# Altium project MB1137.PrjPCB (part 2 of 2)
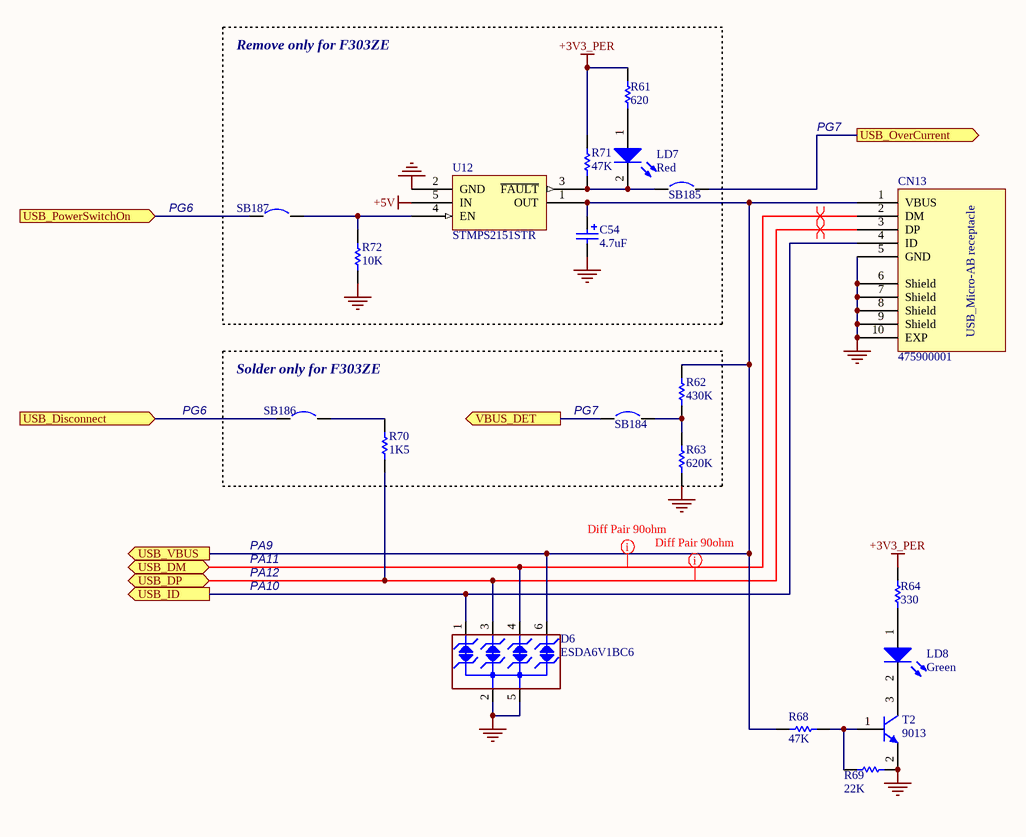
[diagram p6: USB.SchDoc]

## Nets that join several sheets
+3V3: MB1137 (JP5.1 SB2.1 SB3.2), Connectors (CN8.7 CN11.16 SB114.1)
+3V3_PER: MB1137 (SB2.2), Connectors (SB113.1 U7.5), ST_LINK_V2-1 (R25.1), Ethernet (8 pins), USB (R61.2 R64.2 R71.1)
+5V: MB1137 (8 pins), Connectors (CN8.9 CN11.18), ST_LINK_V2-1 (D2.1), USB (U12.5)
AGND: Connectors (CN10.3 CN12.32), MCU_144 (C34.2 SB162.2 SB166.1 U8.31)
AVDD: Connectors (CN7.6 CN10.1 CN12.7), MCU_144 (C34.1 SB12.2 U8.32 U8.33)
E5V: MB1137 (JP3.2), Connectors (CN11.6), ST_LINK_V2-1 (D3.1)
GND: MB1137 (14 pins), Connectors (27 pins), ST_LINK_V2-1 (44 pins), Ethernet (20 pins), MCU_144 (40 pins), USB (14 pins)
U5V: MB1137 (6 pins), Connectors (CN12.8), ST_LINK_V2-1 (5 pins)
VBAT: Connectors (CN11.33), MCU_144 (C57.1 SB156.2 U8.6)
VDD: MB1137 (JP5.2), Connectors (CN11.5), MCU_144 (33 pins)
VIN: MB1137 (C17.1 U5.3), Connectors (CN8.15 CN11.24)
VIN_5V: MB1137 (C18.1 JP3.6 U5.2 U5.4), ST_LINK_V2-1 (D4.1)
BOOT0: Connectors (CN11.7), MCU_144 (R36.1 U8.138)
MCO: ST_LINK_V2-1 (SB112.2), MCU_144 (SB149.1)
NetC54_1: MCU_144 (R35.1), USB (6 pins)
NetCN5_1: ST_LINK_V2-1 (CN5.1 U2.13), MCU_144 (SB5.1)
NetCN5_2: ST_LINK_V2-1 (CN5.2 U2.12), MCU_144 (SB6.1)
NetCN9_15: Connectors (CN9.15 SB136.1), Ethernet (R40.2), MCU_144 (JP6.2)
NetCN13_2: MCU_144 (SB133.1), USB (CN13.2 D6.4)
NetCN13_3: MCU_144 (SB132.1), USB (CN13.3 D6.3 R70.1)
NetCN13_4: MCU_144 (SB125.1), USB (CN13.4 D6.1)
NetJP4_1: MCU_144 (JP4.1), USB (SB184.1 SB185.2)
NetJP7_1: Ethernet (U9.18), MCU_144 (JP7.1)
NetR27_2: MB1137 (R27.2 U4.3), ST_LINK_V2-1 (U2.28)
NetR42_2: Ethernet (R42.2), MCU_144 (SB178.1)
NetR45_2: Ethernet (R45.2), MCU_144 (SB181.1)
NetR46_1: Ethernet (R46.1 U9.12), MCU_144 (SB160.1)
NetR48_2: Ethernet (R48.2), MCU_144 (SB13.1)
NetSB164_1: Ethernet (U9.13), MCU_144 (SB164.1)
NetSB182_2: Ethernet (U9.17), MCU_144 (SB182.2)
NetSB183_2: Ethernet (U9.16), MCU_144 (SB183.2)
NRST: Connectors (CN8.5 CN11.14), ST_LINK_V2-1 (SB111.2), Ethernet (SB177.1), MCU_144 (B2.2 B2.3 C53.2 U8.25)
PA0: Connectors (CN11.28 SB179.1), MCU_144 (SB180.2 U8.34)
PA1: Connectors (CN11.30 SB11.2), MCU_144 (SB13.2 U8.35)
PA2: Connectors (CN12.35 SB159.1), MCU_144 (SB160.2 U8.36)
PA3: Connectors (CN9.1 CN12.37), MCU_144 (U8.37)
PA4: Connectors (CN7.17 CN11.32), MCU_144 (U8.40)
PA5: Connectors (CN7.10 CN12.11 SB119.2), MCU_144 (U8.41)
PA6: Connectors (CN7.12 CN12.13), MCU_144 (U8.42)
PA7: Connectors (CN12.15 SB121.2), MCU_144 (JP6.1 U8.43)
PA8: Connectors (CN12.23 SB115.2), MCU_144 (TP1.1 U8.100)
PA9: Connectors (CN12.21 SB128.2), MCU_144 (SB127.2 U8.101)
PA10: Connectors (CN12.33 SB126.2), MCU_144 (SB125.2 U8.102)
PA11: Connectors (CN12.14), MCU_144 (SB133.2 U8.103)
PA12: Connectors (CN12.12), MCU_144 (SB132.2 U8.104)
PA13: Connectors (CN11.13), ST_LINK_V2-1 (SB108.1), MCU_144 (U8.105)
PA14: Connectors (CN11.15), ST_LINK_V2-1 (SB103.1), MCU_144 (U8.109)
PA15: Connectors (CN7.9 CN11.17), MCU_144 (U8.110)
PB0: Connectors (CN10.31 CN11.34 SB120.1), MCU_144 (U8.46)
PB1: Connectors (CN10.7 CN12.24), MCU_144 (U8.47)
PB2: Connectors (CN10.15 CN12.22 SB137.2), MCU_144 (R73.1 U8.48)
PB3: Connectors (CN7.15 CN12.31), ST_LINK_V2-1 (SB110.2), MCU_144 (U8.133)
PB4: Connectors (CN7.19 CN12.27), MCU_144 (U8.134)
PB5: Connectors (CN7.13 CN12.29 SB122.2), MCU_144 (U8.135)
PB6: Connectors (CN10.13 CN12.17 SB136.2), MCU_144 (U8.136)
PB7: Connectors (CN11.21), MCU_144 (SB139.1 U8.137)
PB8: Connectors (CN7.2 CN12.3 SB138.2), MCU_144 (U8.139)
PB9: Connectors (CN7.4 CN12.5 SB143.2), MCU_144 (U8.140)
PB10: Connectors (CN10.32 CN12.25), MCU_144 (U8.69)
PB11: Connectors (CN10.34 CN12.18), MCU_144 (U8.70)
PB12: Connectors (CN7.7 CN12.16), MCU_144 (U8.73)
PB13: Connectors (CN7.5 CN12.30), MCU_144 (JP7.2 U8.74)
PB14: Connectors (CN12.28), MCU_144 (SB118.1 U8.75)
PB15: Connectors (CN7.3 CN12.26), MCU_144 (U8.76)
PC0: Connectors (CN9.3 CN11.38), MCU_144 (U8.26)
PC1: Connectors (CN11.36 SB165.2), MCU_144 (SB164.2 U8.27)
PC2: Connectors (CN10.9 CN11.35), MCU_144 (U8.28)
PC3: Connectors (CN9.5 CN11.37), MCU_144 (U8.29)
PC4: Connectors (CN12.34 SB150.2 SB151.1), MCU_144 (SB178.2 U8.44)
PC5: Connectors (CN12.6 SB140.2 SB141.1), MCU_144 (SB181.2 U8.45)
PC6: Connectors (CN7.1 CN12.4), MCU_144 (U8.96)
PC7: Connectors (CN7.11 CN12.19), MCU_144 (U8.97)
PC8: Connectors (CN8.2 SB116.1), MCU_144 (U8.98)
PC9: Connectors (CN8.4 SB117.1), MCU_144 (U8.99)
PC10: Connectors (CN8.6 CN11.1), MCU_144 (U8.111)
PC11: Connectors (CN8.8 CN11.2), MCU_144 (U8.112)
PC12: Connectors (CN8.10 CN11.3), MCU_144 (U8.113)
PC13: Connectors (CN11.23), MCU_144 (SB173.1 U8.7)
PC14: Connectors (SB144.1), MCU_144 (R37.2 U8.8)
PC15: Connectors (SB145.1), MCU_144 (R38.2 U8.9)
PD0: Connectors (CN9.25 CN11.57), MCU_144 (U8.114)
PD1: Connectors (CN9.27 CN11.55), MCU_144 (U8.115)
PD2: Connectors (CN8.12 CN11.4), MCU_144 (U8.116)
PD3: Connectors (CN9.10 CN11.40), MCU_144 (U8.117)
PD4: Connectors (CN9.8 CN11.39), MCU_144 (U8.118)
PD5: Connectors (CN9.6 CN11.41), MCU_144 (U8.119)
PD6: Connectors (CN9.4 CN11.43), MCU_144 (U8.122)
PD7: Connectors (CN9.2 CN11.45), MCU_144 (U8.123)
PD8: Connectors (SB7.2), MCU_144 (SB5.2 U8.77)
PD9: Connectors (SB4.1), MCU_144 (SB6.2 U8.78)
PD10: Connectors (CN12.65), MCU_144 (U8.79)
PD11: Connectors (CN12.45 SB174.2 SB175.1), MCU_144 (U8.80)
PD12: Connectors (CN12.43 SB171.2 SB172.1), MCU_144 (U8.81)
PD13: Connectors (CN12.41 SB167.2 SB168.1), MCU_144 (U8.82)
PD14: Connectors (CN7.16 CN12.46), MCU_144 (U8.85)
PD15: Connectors (CN7.18 CN12.48), MCU_144 (U8.86)
PE0: Connectors (CN10.33 CN12.64), MCU_144 (U8.141)
PE1: Connectors (CN11.61), MCU_144 (U8.142)
PE2: Connectors (CN9.14 CN10.25 CN11.46), MCU_144 (U8.1)
PE3: Connectors (CN9.22 CN11.47), MCU_144 (U8.2)
PE4: Connectors (CN9.16 CN11.48), MCU_144 (U8.3)
PE5: Connectors (CN9.18 CN11.50), MCU_144 (U8.4)
PE6: Connectors (CN9.20 CN11.62), MCU_144 (U8.5)
PE7: Connectors (CN10.20 CN12.44), MCU_144 (U8.58)
PE8: Connectors (CN10.18 CN12.40), MCU_144 (U8.59)
PE9: Connectors (CN10.4 CN12.52), MCU_144 (U8.60)
PE10: Connectors (CN10.24 CN12.47), MCU_144 (U8.63)
PE11: Connectors (CN10.6 CN12.56), MCU_144 (U8.64)
PE12: Connectors (CN10.26 CN12.49), MCU_144 (U8.65)
PE13: Connectors (CN10.10 CN12.55), MCU_144 (U8.66)
PE14: Connectors (CN10.28 CN12.51), MCU_144 (U8.67)
PE15: Connectors (CN10.30 CN12.53), MCU_144 (U8.68)
PF0: Connectors (CN11.53 SB176.2), MCU_144 (U8.10)
PF1: Connectors (CN11.51 SB170.2), MCU_144 (U8.11)
PF2: Connectors (CN11.52 SB169.2), MCU_144 (U8.12)
PF3: Connectors (CN12.58 SB15.1 SB146.2), MCU_144 (U8.13)
PF4: Connectors (CN12.38 SB158.1), MCU_144 (U8.14)
PF5: Connectors (CN12.36 SB14.1 SB147.2), MCU_144 (U8.15)
PF6: Connectors (CN11.9), MCU_144 (U8.18)
PF7: Connectors (CN9.26 CN11.11), MCU_144 (U8.19)
PF8: Connectors (CN9.24 CN11.54), MCU_144 (U8.20)
PF9: Connectors (CN9.28 CN11.56), MCU_144 (U8.21)
PF10: Connectors (CN12.42 SB10.1 SB157.2), MCU_144 (U8.22)
PF11: Connectors (CN12.62), MCU_144 (U8.49)
PF12: Connectors (CN7.20 CN12.59), MCU_144 (U8.50)
PF13: Connectors (CN10.2 CN12.57), MCU_144 (U8.53)
PF14: Connectors (CN10.8 CN12.50), MCU_144 (U8.54)
PF15: Connectors (CN10.12 CN12.60), MCU_144 (U8.55)
PG0: Connectors (CN9.29 CN11.59), MCU_144 (U8.56)
PG1: Connectors (CN9.30 CN11.58), MCU_144 (U8.57)
PG2: Connectors (CN8.14 CN11.42), MCU_144 (U8.87)
PG3: Connectors (CN8.16 CN11.44), MCU_144 (U8.88)
PG4: Connectors (CN12.69), MCU_144 (U8.89)
PG5: Connectors (CN12.68), MCU_144 (U8.90)
PG6: Connectors (CN12.70), MCU_144 (U8.91), USB (SB186.1 SB187.1)
PG7: Connectors (CN12.67), MCU_144 (JP4.2 U8.92)
PG8: Connectors (CN12.66), MCU_144 (U8.93)
PG9: Connectors (CN11.63 SB130.1 SB134.1), MCU_144 (U8.124)
PG10: Connectors (CN11.66 SB135.1), MCU_144 (U8.125)
PG11: Connectors (CN11.70), MCU_144 (SB183.1 U8.126)
PG12: Connectors (CN11.65), MCU_144 (U8.127)
PG13: Connectors (CN11.68), MCU_144 (SB182.1 U8.128)
PG14: Connectors (CN12.61 SB131.1), MCU_144 (U8.129)
PG15: Connectors (CN11.64), MCU_144 (U8.132)
PH0: Connectors (SB148.1), MCU_144 (SB8.2 SB149.2 U8.23)
PH1: Connectors (SB163.1), MCU_144 (SB9.2 U8.24)
PH2: Connectors (CN11.67), MCU_144 (SB123.2)